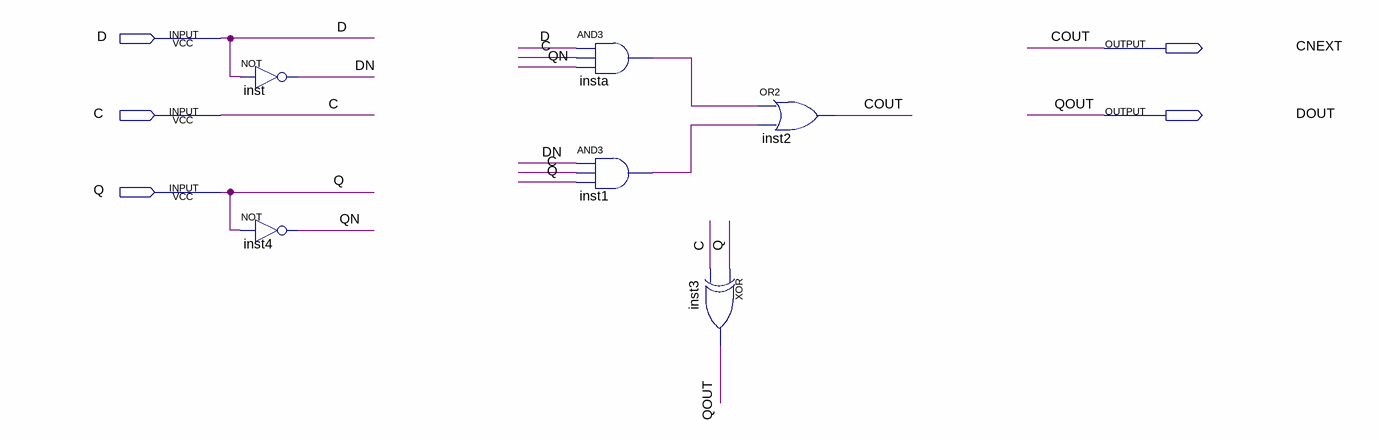
[diagram p0: schematic sheet]
// Quartus schematic HAS.bdf as structural Verilog: 6 symbols, 5 pins
module HAS (
  input  D,
  input  C,
  input  Q,
  output CNEXT,
  output DOUT
);

  wire DN, inst1_out, insta_out, QN;

  not inst (DN, D);
  not inst4 (QN, Q);
  and insta (insta_out, D, C, QN);
  and inst1 (inst1_out, DN, C, Q);
  or inst2 (CNEXT, insta_out, inst1_out);
  xor inst3 (DOUT, Q, C);

  // Other names for the same wires on the sheet: COUT = CNEXT; QOUT = DOUT
endmodule
